# EasyEDA Pro project Project.epro, board UM982_adapter
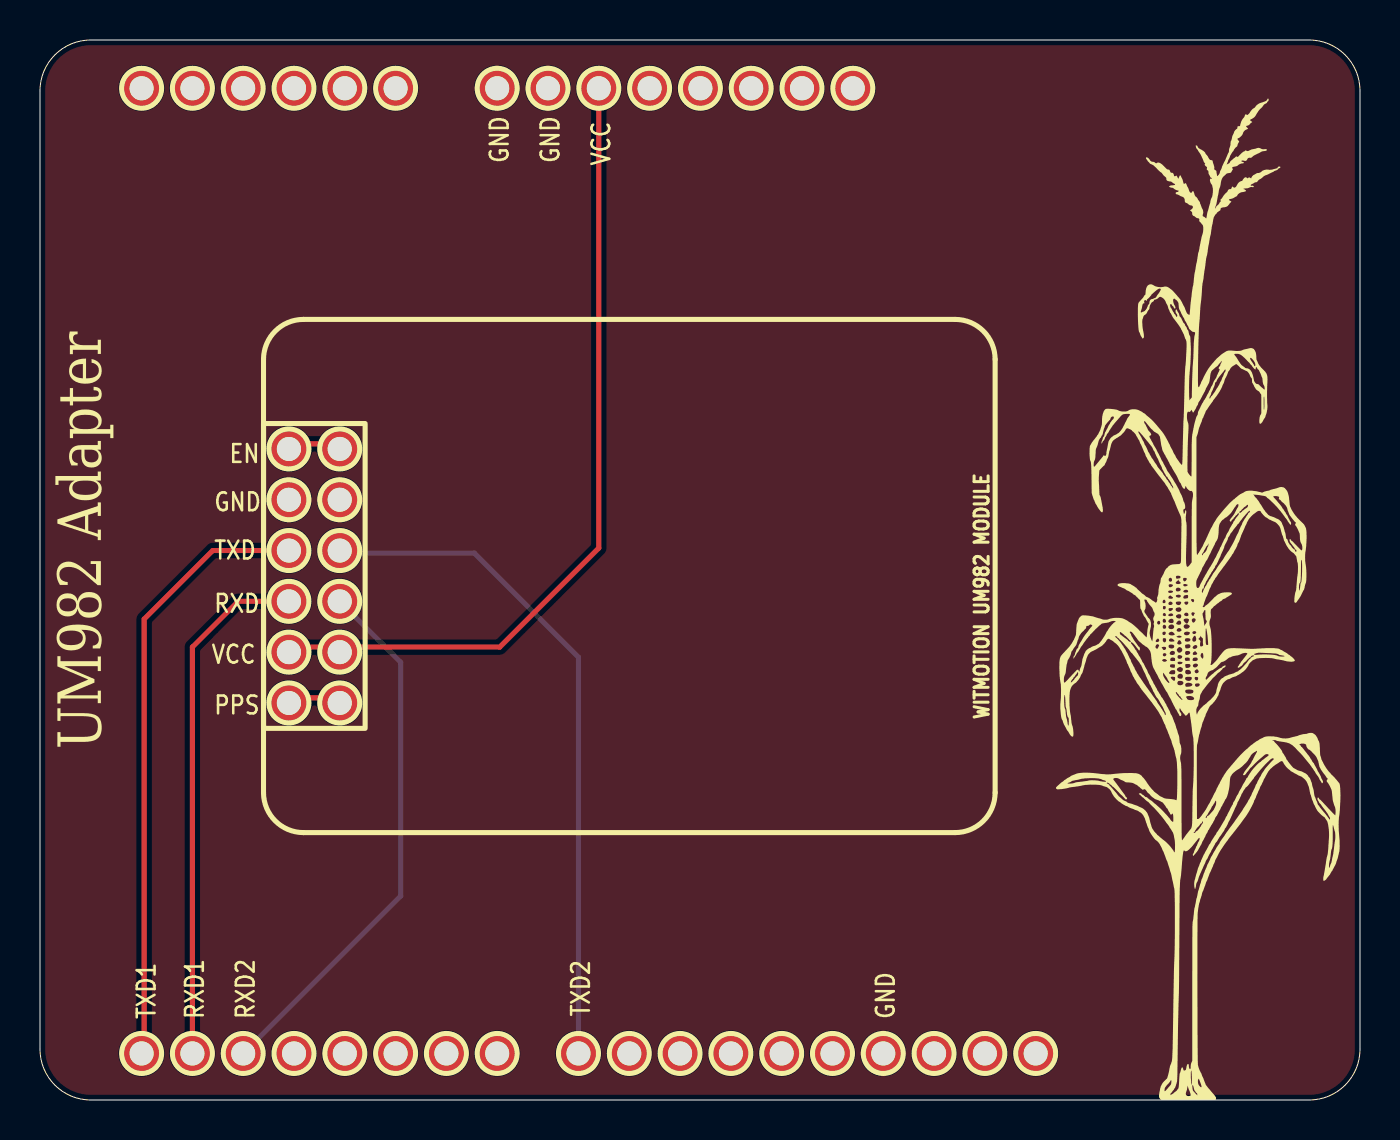
[diagram p2: board, top side]
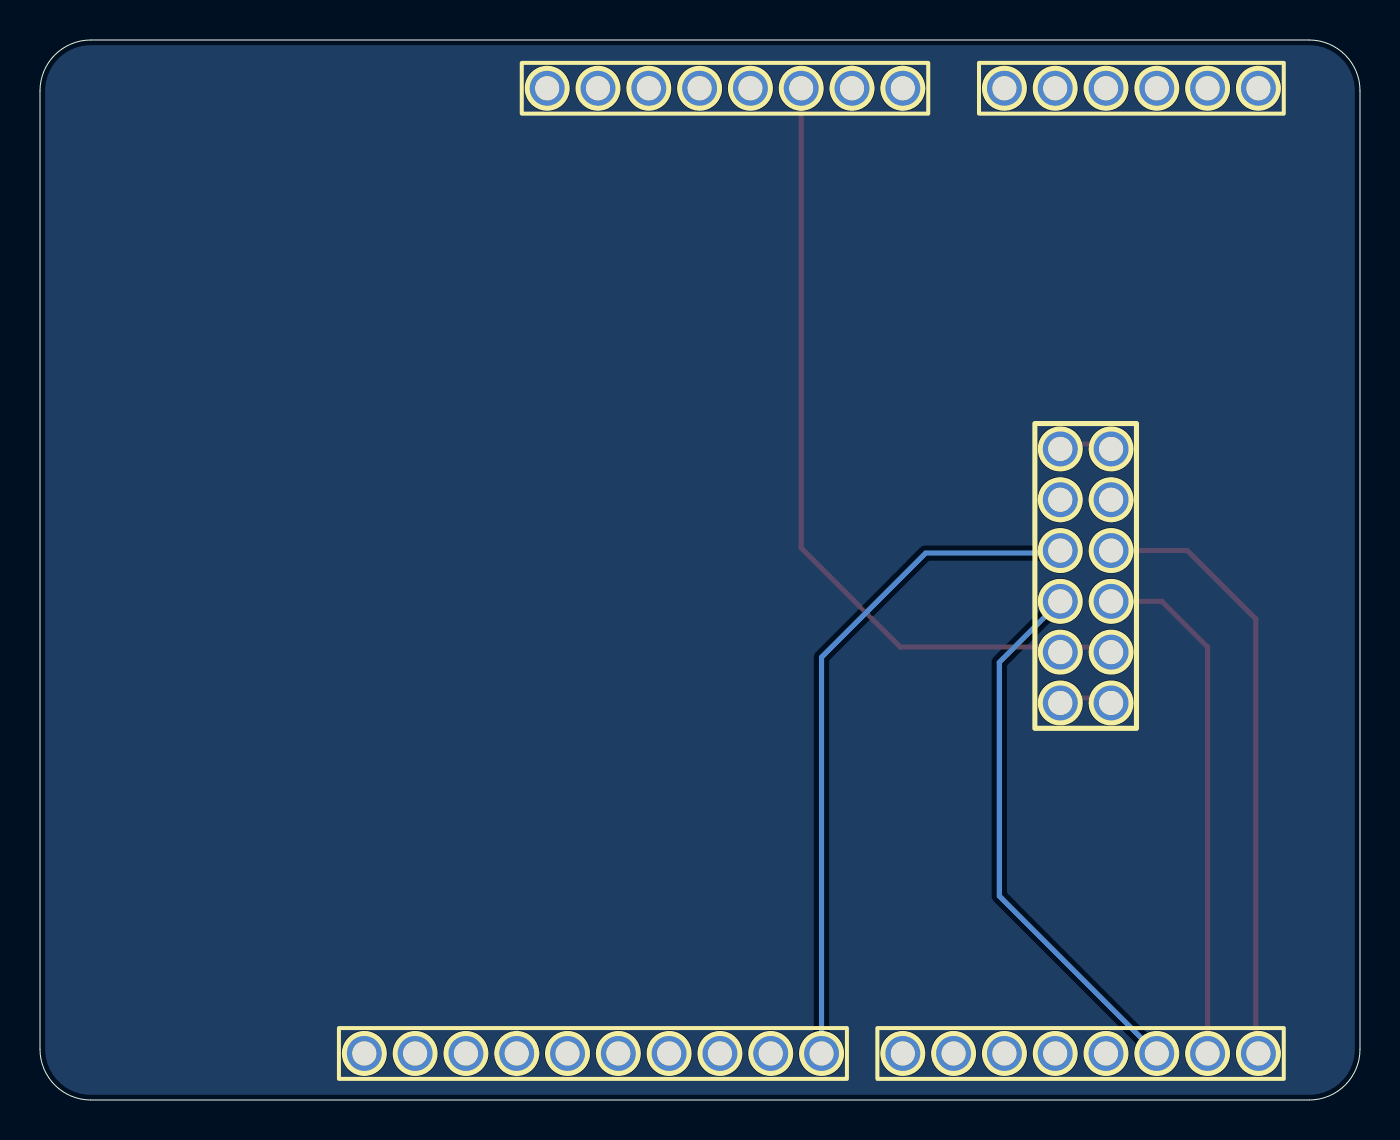
[diagram p3: board, bottom side, seen from below]

Outline 66 x 53 mm; copper layers: Top Layer, Bottom Layer. Coordinates in mm from the lower left corner of the outline.
Outline path: 0,50.46 0,2.54 arc(0.74,0.74) 2.54,0 63.46,0 arc(65.26,0.74) 66,2.54 66,50.46 arc(65.26,52.26) 63.46,53 2.54,53 arc(0.74,52.26) 0,50.46
Stack: Top Layer 0.035mm / Dielectric1 1.51mm FR4 er 4.5 / Bottom Layer 0.035mm

## Design rules (mm)
template: JLCPCB Capability(Two Layers Board)
spacing copperThickness1oz (default): track to track 0.102, other pairs 0.152 to 0.3
spacing copperThickness2oz: track to track 0.203, other pairs 0.152 to 0.3
track width copperThickness1oz (default): min 0.127, default 0.254, max 2.54
track width copperThickness2oz: min 0.203, default 0.254, max 2.54
differential pair differentialPair (default): width min 0.127, default 0.254, max 2.54; gap min 0.152, default 0.152
via viaSize (default): diameter min 0.5, default 0.61, max 10; hole min 0.3, default 0.305, max 6.3

## Placement (name value [footprint] x y rotation side)
NOREF  -  [Pad_e163]  49.78 2.33 90 top
NOREF#2  -  [Pad_e147]  25.4 50.59 90 top
NOREF#3  -  [Pad_e141]  15.24 2.33 90 top
NOREF#4  -  [Pad_e131]  12.45 22.39 0 top
NOREF#5  -  [Pad_e146]  22.86 50.59 90 top
NOREF#6  -  [Pad_e122]  7.62 50.59 90 top
NOREF#7  -  [Pad_e120]  5.08 50.59 90 top
NOREF#8  -  [Pad_e127]  12.45 30.01 0 top
NOREF#9  -  [Pad_e126]  12.45 32.55 0 top
NOREF#10  -  [Pad_e134]  14.99 30.01 0 top
NOREF#11  -  [Pad_e140]  15.24 50.59 90 top
NOREF#12  -  [Pad_e121]  5.08 2.33 90 top
NOREF#13  -  [Pad_e159]  40.64 50.59 90 top
NOREF#14  -  [Pad_e158]  39.62 2.33 90 top
NOREF#15  -  [Pad_e129]  12.45 24.93 0 top
NOREF#16  -  [Pad_e151]  30.48 50.59 90 top
NOREF#17  -  [Pad_e133]  12.7 2.33 90 top
NOREF#18  -  [Pad_e128]  12.45 27.47 0 top
NOREF#19  -  [Pad_e136]  14.99 24.93 0 top
NOREF#20  -  [Pad_e130]  12.45 19.85 0 top
NOREF#21  -  [Pad_e139]  14.99 19.85 0 top
NOREF#22  -  [Pad_e123]  7.62 2.33 90 top
NOREF#23  -  [Pad_e156]  37.08 2.33 90 top
NOREF#24  -  [Pad_e124]  10.16 50.59 90 top
NOREF#25  -  [Pad_e162]  47.24 2.33 90 top
NOREF#26  -  [Pad_e142]  17.78 50.59 90 top
NOREF#27  -  [Pad_e144]  20.32 2.33 90 top
NOREF#28  -  [Pad_e143]  17.78 2.33 90 top
NOREF#29  -  [Pad_e157]  38.1 50.59 90 top
NOREF#30  -  [Pad_e160]  42.16 2.33 90 top
NOREF#31  -  [Pad_e132]  12.7 50.59 90 top
NOREF#32  -  [Pad_e148]  26.92 2.33 90 top
NOREF#33  -  [Pad_e149]  27.94 50.59 90 top
NOREF#34  -  [Pad_e125]  10.16 2.33 90 top
NOREF#35  -  [Pad_e154]  34.54 2.33 90 top
NOREF#36  -  [Pad_e135]  14.99 27.47 0 top
NOREF#37  -  [Pad_e153]  33.02 50.59 90 top
NOREF#38  -  [Pad_e150]  29.46 2.33 90 top
NOREF#39  -  [Pad_e138]  14.99 32.55 0 top
NOREF#40  -  [Pad_e145]  22.86 2.33 90 top
NOREF#41  -  [Pad_e155]  35.56 50.59 90 top
NOREF#42  -  [Pad_e152]  32 2.33 90 top
NOREF#43  -  [Pad_e161]  44.7 2.33 90 top
NOREF#44  -  [Pad_e137]  14.99 22.39 0 top

## Footprints (pads in the part's own frame, mm; a bottom-side part is the same pattern mirrored in y, then rotated)
Pad_e120
  round 1.8 hole 1.205x1.2: 19(0,0)
Pad_e121
  round 1.8 hole 1.205x1.2: 1(0,0)
Pad_e122
  round 1.8 hole 1.205x1.2: 20(0,0)
Pad_e123
  round 1.8 hole 1.205x1.2: 2(0,0)
Pad_e124
  round 1.8 hole 1.205x1.2: 21(0,0)
Pad_e125
  round 1.8 hole 1.205x1.2: 3(0,0)
Pad_e126
  round 1.8 hole 1.205x1.2: 33(0,0)
Pad_e127
  round 1.8 hole 1.205x1.2: 34(0,0)
Pad_e128
  round 1.8 hole 1.205x1.2: 35(0,0)
Pad_e129
  round 1.8 hole 1.205x1.2: 36(0,0)
Pad_e130
  round 1.8 hole 1.205x1.2: 38(0,0)
Pad_e131
  round 1.8 hole 1.205x1.2: 37(0,0)
Pad_e132
  round 1.8 hole 1.205x1.2: 22(0,0)
Pad_e133
  round 1.8 hole 1.205x1.2: 4(0,0)
Pad_e134
  round 1.8 hole 1.205x1.2: 40(0,0)
Pad_e135
  round 1.8 hole 1.205x1.2: 41(0,0)
Pad_e136
  round 1.8 hole 1.205x1.2: 42(0,0)
Pad_e137
  round 1.8 hole 1.205x1.2: 43(0,0)
Pad_e138
  round 1.8 hole 1.205x1.2: 39(0,0)
Pad_e139
  round 1.8 hole 1.205x1.2: 44(0,0)
Pad_e140
  round 1.8 hole 1.205x1.2: 23(0,0)
Pad_e141
  round 1.8 hole 1.205x1.2: 5(0,0)
Pad_e142
  round 1.8 hole 1.205x1.2: 24(0,0)
Pad_e143
  round 1.8 hole 1.205x1.2: 6(0,0)
Pad_e144
  round 1.8 hole 1.205x1.2: 7(0,0)
Pad_e145
  round 1.8 hole 1.205x1.2: 8(0,0)
Pad_e146
  round 1.8 hole 1.205x1.2: 25(0,0)
Pad_e147
  round 1.8 hole 1.205x1.2: 26(0,0)
Pad_e148
  round 1.8 hole 1.205x1.2: 9(0,0)
Pad_e149
  round 1.8 hole 1.205x1.2: 27(0,0)
Pad_e150
  round 1.8 hole 1.205x1.2: 10(0,0)
Pad_e151
  round 1.8 hole 1.205x1.2: 28(0,0)
Pad_e152
  round 1.8 hole 1.205x1.2: 11(0,0)
Pad_e153
  round 1.8 hole 1.205x1.2: 29(0,0)
Pad_e154
  round 1.8 hole 1.205x1.2: 12(0,0)
Pad_e155
  round 1.8 hole 1.205x1.2: 30(0,0)
Pad_e156
  round 1.8 hole 1.205x1.2: 13(0,0)
Pad_e157
  round 1.8 hole 1.205x1.2: 31(0,0)
Pad_e158
  round 1.8 hole 1.205x1.2: 14(0,0)
Pad_e159
  round 1.8 hole 1.205x1.2: 32(0,0)
Pad_e160
  round 1.8 hole 1.205x1.2: 15(0,0)
Pad_e161
  round 1.8 hole 1.205x1.2: 16(0,0)
Pad_e162
  round 1.8 hole 1.205x1.2: 17(0,0)
Pad_e163
  round 1.8 hole 1.205x1.2: 18(0,0)

## Nets
GND: NOREF#2.26 NOREF#5.25 NOREF#8.34 NOREF#10.40 NOREF#30.15
VCC: NOREF#4.37 NOREF#33.27 NOREF#44.43
EN: NOREF#9.33 NOREF#39.39
PPS: NOREF#20.38 NOREF#21.44
RXD: NOREF#15.36 NOREF#22.2
RXD2: NOREF#19.42 NOREF#34.3
TXD: NOREF#12.1 NOREF#18.35
TXD2: NOREF#32.9 NOREF#36.41

Pads without a net: NOREF 18; NOREF#3 5; NOREF#6 20; NOREF#7 19; NOREF#11 23; NOREF#13 32; NOREF#14 14; NOREF#16 28; NOREF#17 4; NOREF#23 13; NOREF#24 21; NOREF#25 17; NOREF#26 24; NOREF#27 7; NOREF#28 6; NOREF#29 31; NOREF#31 22; NOREF#35 12; NOREF#37 29; NOREF#38 10; NOREF#40 8; NOREF#41 30; NOREF#42 11; NOREF#43 16

## Routing (per net, layer and track width the routed paths; a pad name or vN(x,y) marks a point on that pad's centre or on a via; arc(x,y) is an arc through that point)
VCC: length 40.8
  Top Layer w0.254: 27.94,50.84 27.94,27.6 22.99,22.65 12.45,22.65
EN: length 2.5
  Top Layer w0.254: 12.45,32.81 14.99,32.81
PPS: length 2.5
  Top Layer w0.254: 12.45,20.11 14.99,20.11
RXD: length 26.1
  Top Layer w0.254: NOREF#15.36 9.91,24.93 7.62,22.65 NOREF#22.2
RXD2: length 27.1
  Bottom Layer w0.254: NOREF#19.42 18.03,21.88 18.03,10.2 NOREF#34.3
TXD: length 30.4
  Top Layer w0.254: NOREF#12.1 5.21,2.45 5.21,24.04 8.64,27.47 NOREF#18.35
TXD2: length 34
  Bottom Layer w0.254: NOREF#32.9 26.92,22.14 21.72,27.35 15.11,27.35 NOREF#36.41

## Copper pours and planes (outline as drawn; the poured copper is in the pictures)
GND on Top Layer: 0,53 66,53 66,0 0,0
GND on Bottom Layer: 0,53 66,53 66,0 0,0

## Text on the board
Top Silkscreen Layer: WITMOTION UM982 MODULE | VCC | GND | TXD | RXD | PPS | EN | TXD1 | RXD1 | RXD2 | TXD2 | UM982 Adapter
